# Altium schematic sheet LED_Point_Gate Drive.SchDoc
size A; DocumentNumber: 8; SheetNumber: 9; SheetTotal: 9
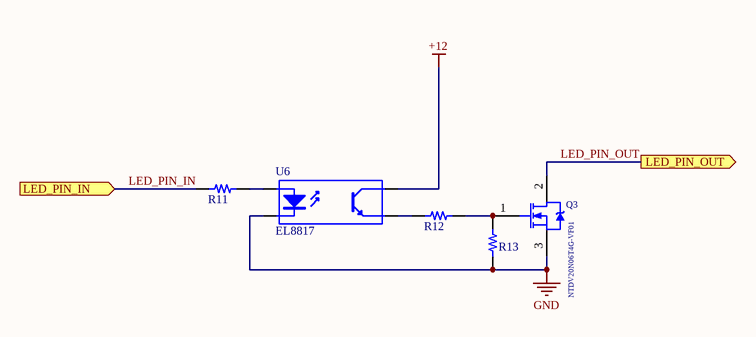
[diagram p0: LED_Point_Gate Drive.SchDoc]

## Parts
Q3  NTDV20N06T4G-VF01  [DPAK228P991X238-3N]
R11  1K  [RES SMD 0805]  (value not drawn)
R12  48R  [RES SMD 0805]  (value not drawn)
R13  10K  [RES SMD 0805]  (value not drawn)
U6  EL8817  [DIP-4 GULLWING]

## Ports
LED_PIN_IN (in), LED_PIN_OUT (out)

## Nets
+12: U6.4(C)
GND: Q3.3(S) R13.1 U6.2(K)
LED_PIN_IN: R11.1 ; port LED_PIN_IN
LED_PIN_OUT: Q3.2(D) ; port LED_PIN_OUT
NetQ3_1: Q3.1(G) R12.2 R13.2
NetR11_2: R11.2 U6.1(A)
NetR12_1: R12.1 U6.3(E)

## Library data of the parts
Q3 = IRF540NS: MOSFET N-CH 60V 20A DPAK; Manufacture: ON Semiconductor; Manufacture Part Number: IRF540N_R4942; Published: 8-Jun-2000; LatestRevisionDate: 20-Nov-2009; LatestRevisionNote: IPC-7351 Footprint Added.; DatasheetVersion: May-1998; PackageReference: TO-220AB; Publisher: Altium Limited; PackageDescription: TO, Thru-Hole, Vertical, Heatsink Mounted; 3 In-Line Leads; Pitch 2.54 mm; ComponentLink1Description: Manufacturer Link; ComponentLink1URL: http://www.irf.com/; ComponentLink2Description: Datasheet; ComponentLink2URL: http://www.irf.com/product-info/datasheets/data/irf540ns.pdf; Supplier: Local; Supplier Part Number: IRF540N
R11 = RESISTOR: RES SMD 1K OHM 1% 1/4W 0805
R12 = RESISTOR: RES SMD 48 OHM 1% 1/4W 0805
R13 = RESISTOR: RES SMD 10K OHM 1% 1/4W 0805
U6 = PC817: Optoisolator Transistor Output 5000Vrms 1 Channel 4-SMD